# Altium project led_driver.PrjPcb
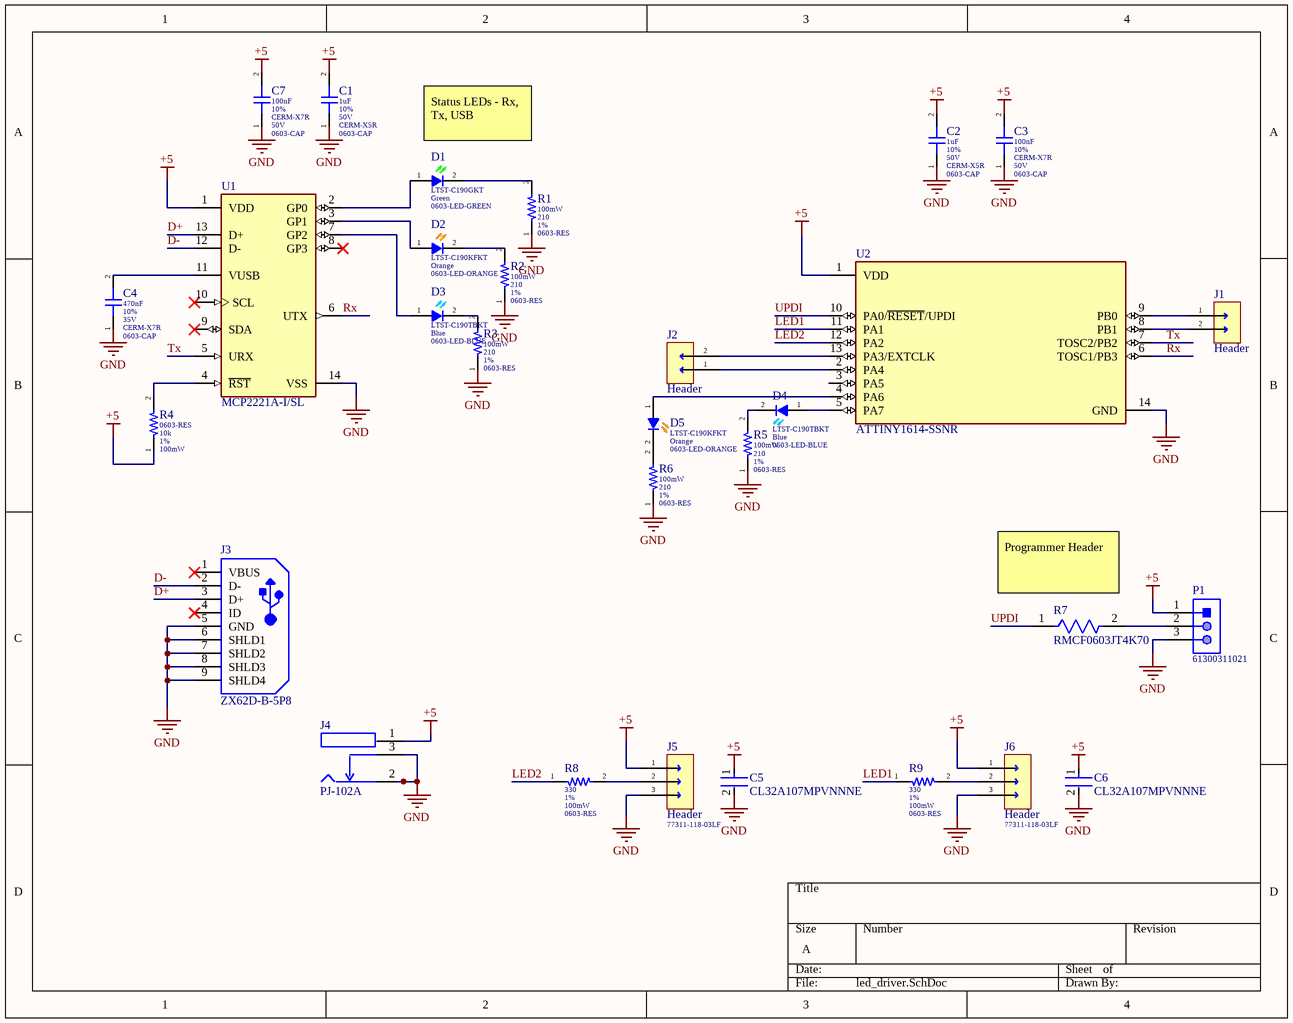
[diagram p0: led_driver.SchDoc]
1 sheet, 30 parts. Net scope: global (net labels, ports and power ports of the same name join across sheets).
Board file: led_driver.PcbDoc

## Sheet led_driver.SchDoc
size A; SheetNumber: 1; SheetTotal: 1

### Parts
C1  Capacitance: 1uF  Tolerance: 10%  Voltage Rating: 50V  Dielectric: CERM-X5R  [0603-CAP]  (hidden comment: CAP SAMSUNG CL10A105KB8NNNC)
C2  Capacitance: 1uF  Tolerance: 10%  Voltage Rating: 50V  Dielectric: CERM-X5R  [0603-CAP]  (hidden comment: CAP SAMSUNG CL10A105KB8NNNC)
C3  Capacitance: 100nF  Tolerance: 10%  Dielectric: CERM-X7R  Voltage: 50V  [0603-CAP]  (hidden comment: CAP TDK CGA3E2X7R1H104K080AA)
C4  Capacitance: 470nF  Tolerance: 10%  Voltage Rating: 35V  Dielectric: CERM-X7R  [0603-CAP]  (hidden comment: CAP TDK CGA3E1X7R1V474K080AC)
C5  CL32A107MPVNNNE  [FP-CL32-IPC_C]
C6  CL32A107MPVNNNE  [FP-CL32-IPC_C]
C7  Capacitance: 100nF  Tolerance: 10%  Dielectric: CERM-X7R  Voltage: 50V  [0603-CAP]  (hidden comment: CAP TDK CGA3E2X7R1H104K080AA)
D1  Manufacturer Part Number: LTST-C190GKT  Color: Green  [0603-LED-GREEN]  (hidden comment: LED LITE-ON LTST-C190GKT)
D2  Manufacturer Part Number: LTST-C190KFKT  Color: Orange  [0603-LED-ORANGE]  (hidden comment: LED LITE-ON LTST-C190KFKT)
D3  Manufacturer Part Number: LTST-C190TBKT  Color: Blue  [0603-LED-BLUE]  (hidden comment: LED LITE-ON LTST-C190TBKT)
D4  Manufacturer Part Number: LTST-C190TBKT  Color: Blue  [0603-LED-BLUE]  (hidden comment: LED LITE-ON LTST-C190TBKT)
D5  Manufacturer Part Number: LTST-C190KFKT  Color: Orange  [0603-LED-ORANGE]  (hidden comment: LED LITE-ON LTST-C190KFKT)
J1  Header  [HEADER 2POS 1ROW 2.54MM W/O BODY]
J2  Header  [HEADER 2POS 1ROW 2.54MM W/O BODY]
J3  ZX62D-B-5P8  [HIRO-ZX62D-B-5P8_V]
J4  PJ-102A  [FP-PJ-102A-MFG]
J5  Header  Manufacturer Part Number: 77311-118-03LF  [HEADER 3POS 1ROW 2.54MM]
J6  Header  Manufacturer Part Number: 77311-118-03LF  [HEADER 3POS 1ROW 2.54MM]
P1  61300311021  [61300311021]
R1  Power Rating: 100mW  Resistance: 210  Tolerance: 1%  [0603-RES]  (hidden comment: RES KOA RK73H1JTTD2100F)
R2  Power Rating: 100mW  Resistance: 210  Tolerance: 1%  [0603-RES]  (hidden comment: RES KOA RK73H1JTTD2100F)
R3  Power Rating: 100mW  Resistance: 210  Tolerance: 1%  [0603-RES]  (hidden comment: RES KOA RK73H1JTTD2100F)
R4  Resistance: 10k  Tolerance: 1%  Power: 100mW  [0603-RES]  (hidden comment: RES BOURNS CR0603AFX-1002EAS)
R5  Power Rating: 100mW  Resistance: 210  Tolerance: 1%  [0603-RES]  (hidden comment: RES KOA RK73H1JTTD2100F)
R6  Power Rating: 100mW  Resistance: 210  Tolerance: 1%  [0603-RES]  (hidden comment: RES KOA RK73H1JTTD2100F)
R7  RMCF0603JT4K70  [FP-RMCF0603-MFG]
R8  Resistance: 330  Tolerance: 1%  Power Rating: 100mW  [0603-RES]  (hidden comment: RES KOA RK73H1JTTD3300F)
R9  Resistance: 330  Tolerance: 1%  Power Rating: 100mW  [0603-RES]  (hidden comment: RES KOA RK73H1JTTD3300F)
U1  MCP2221A-I/SL  [FP-C04-065-SL-MFG]
U2  ATTINY1614-SSNR  [FP-C04-065-D3X-MFG]

### Nets
+5: C1.2 C2.2 C3.2 C5.1 C6.1 C7.2 J4.1 J5.1 J6.1 P1.1 R4.1 U1.1(VDD) U2.1(VDD)
GND: C1.1 C2.1 C3.1 C4.1 C5.2 C6.2 C7.1 J3.5(GND) J3.6(SHLD1) J3.7(SHLD2) J3.8(SHLD3) J3.9(SHLD4) J4.2 J4.3 J5.3 J6.3 P1.3 R1.1 R2.1 R3.1 R5.1 R6.1 U1.14(VSS) U2.14(GND)
D+: J3.3(D+) U1.13(D+)
D-: J3.2(D-) U1.12(D-)
LED1: R9.1 U2.11(PA1)
LED2: R8.1 U2.12(PA2)
Rx: U1.6(UTX) U2.6(TOSC1/PB3)
Tx: U1.5(URX) U2.7(TOSC2/PB2)
UPDI: R7.1 U2.10(PA0/~{RESET}/UPDI)
NetC4_2: C4.2 U1.11(VUSB)
NetD1_1: D1.1 U1.2(GP0)
NetD1_2: D1.2 R1.2
NetD2_1: D2.1 U1.3(GP1)
NetD2_2: D2.2 R2.2
NetD3_1: D3.1 U1.7(GP2)
NetD3_2: D3.2 R3.2
NetD4_1: D4.1 U2.5(PA7)
NetD4_2: D4.2 R5.2
NetD5_1: D5.1 U2.4(PA6)
NetD5_2: D5.2 R6.2
NetJ1_1: J1.1 U2.9(PB0)
NetJ1_2: J1.2 U2.8(PB1)
NetJ2_1: J2.1 U2.2(PA4)
NetJ2_2: J2.2 U2.13(PA3/EXTCLK)
NetJ5_2: J5.2 R8.2
NetJ6_2: J6.2 R9.2
NetP1_2: P1.2 R7.2
NetR4_2: R4.2 U1.4(~{RST})

Not connected (* = marked no-connect by the designer): J3 1(VBUS)* 4(ID)*; U1 8(GP3)* 9(SDA)* 10(SCL)*; U2 3(PA5)

### Notes on the sheet
- Status LEDs - Rx, Tx, USB
- (near R7) Programmer Header

### Library data of the parts
C1 C2 = CAP SAMSUNG CL10A105KB8NNNC: CAP CER 1UF 50V X5R 0603; Supplier 1: Digi-Key; Manufacturer: Samsung; Manufacturer Part Number: CL10A105KB8NNNC; Stock 1: 2147093; Pricing 1: 1=0.17, 10=0.121, 100=0.0568, 500=0.0398, 1000=0.033 (USD); Mount: Surface Mount; Case/Package: 0603; Case Code (Metric): 1608; Case Code (Imperial): 0603; Contact Plating: Tin; Min Operating Temperature: -55°C; Max Operating Temperature: 85°C; Package Quantity: 1; Packaging: Tape and Reel; Termination: Wraparound; Length: 1.6mm; Width: 0.031inch; Thickness: 0.035inch; Depth: 0.8mm; Radiation Hardening: No; ComponentLink1URL: https://www.verical.com/server-webapp/html/getDatasheet?partID=753736&src-supplier=Verical; ComponentLink1Description: https://www.verical.com/server-webapp/html/getDatasheet?partID=753736&src-supplier=Verical; Supplier Part Number 1: 1276-1860-1-ND; CurrentFootprint: 0603-CAP
C3 C7 = CAP TDK CGA3E2X7R1H104K080AA: CAP CER 0.1UF 50V X7R 0603; Supplier 1: Digi-Key; Manufacturer: TDK; Manufacturer Part Number: CGA3E2X7R1H104K080AA; Stock 1: 11391991; Pricing 1: 1=0.1, 10=0.075, 100=0.0335, 500=0.0239, 1000=0.0188 (USD); Mount: Surface Mount; Case/Package: 0603; Weight: 7.1E-05oz; Case Code (Imperial): 0603; Case Code (Metric): 1608; Min Operating Temperature: -55°C; Max Operating Temperature: 125°C; Voltage Rating (DC): 50V; Packaging: Tape and Reel; Package Quantity: 1; Voltage Rating: 50V; Termination: SMD/SMT; Composition: Ceramic; Length: 1.6mm; Height: 0.8mm; Width: 0.8mm; Thickness: 0.035inch; Depth: 0.8mm; Ratings: AEC-Q200; Radiation Hardening: No; REACH SVHC: No SVHC; Lead Free: Lead Free; ComponentLink1URL: http://www.farnell.com/datasheets/1796654.pdf?src-supplier=Mouser; ComponentLink1Description: http://www.farnell.com/datasheets/1796654.pdf?src-supplier=Mouser; ComponentLink2URL: http://product.tdk.com/capacitor/mlcc/en/documents/mlccspec_automotive_general_midvoltage_en.pdf?src-supplier=Future+Electronics; ComponentLink2Description: http://product.tdk.com/capacitor/mlcc/en/documents/mlccspec_automotive_general_midvoltage_en.pdf?src-supplier=Future+Electronics; ComponentLink3URL: http://www.farnell.com/datasheets/1735392.pdf?src-supplier=Element14; ComponentLink3Description: http://www.farnell.com/datasheets/1735392.pdf?src-supplier=Element14; ComponentLink4URL: https://www.verical.com/server-webapp/html/getDatasheet?partID=715867&src-supplier=Verical; ComponentLink4Description: https://www.verical.com/server-webapp/html/getDatasheet?partID=715867&src-supplier=Verical; ComponentLink5URL: http://www.farnell.com/datasheets/1796654.pdf?src-supplier=Newark; ComponentLink5Description: http://www.farnell.com/datasheets/1796654.pdf?src-supplier=Newark; Supplier Part Number 1: 445-5666-1-ND; CurrentFootprint: 0603-CAP
C4 = CAP TDK CGA3E1X7R1V474K080AC: CAP CER 0.47UF 35V X7R 0603; Supplier 1: Digi-Key; Manufacturer: TDK; Manufacturer Part Number: CGA3E1X7R1V474K080AC; Stock 1: 14632; Pricing 1: 1=0.26, 10=0.181, 100=0.1026, 500=0.0725, 1000=0.0634 (USD); Mount: Surface Mount; Case/Package: 0603; Weight: 7.1E-05oz; Case Code (Imperial): 0603; Case Code (Metric): 1608; Min Operating Temperature: -55°C; Max Operating Temperature: 125°C; Packaging: Tape and Reel; Voltage Rating (DC): 35V; Package Quantity: 1; Termination: SMD/SMT; Composition: Ceramic; Length: 1.6mm; Height: 0.8mm; Width: 0.8mm; Thickness: 0.035inch; Depth: 0.8mm; Ratings: AEC-Q200; REACH SVHC: No SVHC; ComponentLink1URL: http://product.tdk.com/capacitor/mlcc/detailed_information.php?lang=en&amp;ref=jp&amp;part_no=CGA3E1X7R1V474K080AC&src-supplier=Mouser; ComponentLink1Description: http://product.tdk.com/capacitor/mlcc/detailed_information.php?lang=en&amp;ref=jp&amp;part_no=CGA3E1X7R1V474K080AC&src-supplier=Mouser; ComponentLink2URL: http://www.farnell.com/datasheets/1796654.pdf?src-supplier=Element14; ComponentLink2Description: http://www.farnell.com/datasheets/1796654.pdf?src-supplier=Element14; Supplier Part Number 1: 445-6928-1-ND; CurrentFootprint: 0603-CAP
C5 C6 = CMP-13271-001285-1: Cap Ceramic 100uF 10V X5R ±20% SMD 1210 +85°C Embossed T/R; Dielectric: X5R; Depth: 2.5mm; Width: 0.098inch; Voltage: 10V; Length: 3.2mm; Capacitance: 100uF; Radiation Hardening: No; Min Operating Temperature: -55°C; Thickness: 0.11inch; Mount: Surface Mount; Case Code (Imperial): 1210; Material: Ceramic; Tolerance: 20%; Contact Plating: Tin; Max Operating Temperature: 85°C; Voltage Rating: 10V; Lead Free: Lead Free; Case Code (Metric): 3225; Height: 2.5mm; Case/Package: 1210; Packaging: Tape and Reel; Voltage Rating (DC): 10V
D1 = LED LITE-ON LTST-C190GKT: LED GREEN CLEAR CHIP SMD; Manufacturer: Vishay Lite-On; Lens Color: Colorless; Luminous Intensity: 6mcd; Forward Voltage: 2.1V; Viewing Angle: 130°; Lens Style: Clear,Diffused,Colorless,Rectangular; Forward Current: 30mA; Power Rating: 100mW; Dominant Wavelength: 569nm; Test Current: 10mA; Number of Elements: 1; Wavelength: 565nm; Voltage: 2V; Reverse Voltage: 5V; Supplier 1: Digi-Key; Stock 1: 773896; Pricing 1: 1=0.26, 10=0.188, 100=0.0888, 500=0.0592, 1000=0.0464 (USD); Mount: Surface Mount; Case/Package: 0603; Number of Pins: 2; Case Code (Metric): 1608; Case Code (Imperial): 0603; Min Operating Temperature: -55°C; Max Operating Temperature: 85°C; Package Quantity: 1; Packaging: Tape and Reel; Illumination Color: Green; Lens Transparency: Clear; Power Dissipation: 100mW; Number of LEDs: 1; Length: 1.6mm; Height: 0.8mm; Width: 0.8mm; Depth: 0.8mm; Radiation Hardening: No; Lead Free: Lead Free; ComponentLink1URL: http://uk.rs-online.com/webdocs/0dc0/0900766b80dc02a6.pdf?src-supplier=RSComponents; ComponentLink1Description: http://uk.rs-online.com/webdocs/0dc0/0900766b80dc02a6.pdf?src-supplier=RSComponents; ComponentLink2URL: https://media.digikey.com/pdf/Data%20Sheets/Lite-On%20PDFs/LTST-C190GKT.pdf?src-supplier=Digi-Key; ComponentLink2Description: https://media.digikey.com/pdf/Data%20Sheets/Lite-On%20PDFs/LTST-C190GKT.pdf?src-supplier=Digi-Key; ComponentLink3URL: http://www1.futureelectronics.com/doc/LITE%20ON/LITE-ON%20LTST-C190GKT.pdf?src-supplier=Future+Electronics; ComponentLink3Description: http://www1.futureelectronics.com/doc/LITE%20ON/LITE-ON%20LTST-C190GKT.pdf?src-supplier=Future+Electronics; ComponentLink4URL: https://media.digikey.com/pdf/Data%20Sheets/Lite-On%20PDFs/LTST-C190GKT.pdf?src-supplier=Mouser; ComponentLink4Description: https://media.digikey.com/pdf/Data%20Sheets/Lite-On%20PDFs/LTST-C190GKT.pdf?src-supplier=Mouser; Supplier Part Number 1: 160-1183-1-ND; CurrentFootprint: 0603-LED-GREEN
D2 D5 = LED LITE-ON LTST-C190KFKT: LED ORANGE CLEAR CHIP SMD; Manufacturer: Vishay Lite-On; Lens Color: Colorless; Power Rating: 75mW; Luminous Intensity: 90mcd; Viewing Angle: 130°; Forward Current: 30mA; Forward Voltage: 2V; Lens Style: Diffused,Colorless,Clear,Rectangular; Dominant Wavelength: 605nm; Test Current: 20mA; Number of Elements: 1; Wavelength: 611nm; Reverse Voltage: 5V; Supplier 1: Digi-Key; Stock 1: 52285; Pricing 1: 1=0.24, 10=0.175, 100=0.0827, 500=0.0551, 1000=0.0432 (USD); Mount: Surface Mount; Case/Package: 0603; Number of Pins: 2; Case Code (Metric): 1608; Case Code (Imperial): 0603; Min Operating Temperature: -55°C; Max Operating Temperature: 85°C; Packaging: Tape and Reel; Package Quantity: 1; Illumination Color: Orange; Lens Transparency: Clear; Power Dissipation: 75mW; Number of LEDs: 1; Length: 3.2mm; Height: 0.8mm; Width: 0.8mm; Depth: 1.6mm; Radiation Hardening: No; Lead Free: Lead Free; ComponentLink1URL: http://www.mouser.com/ds/2/239/LTST-C190KFKT-1141312.pdf?src-supplier=Mouser; ComponentLink1Description: http://www.mouser.com/ds/2/239/LTST-C190KFKT-1141312.pdf?src-supplier=Mouser; ComponentLink2URL: http://www1.futureelectronics.com/doc/LITE%20ON/LITE-ON%20LTST-C190KFKT.pdf?src-supplier=Future+Electronics; ComponentLink2Description: http://www1.futureelectronics.com/doc/LITE%20ON/LITE-ON%20LTST-C190KFKT.pdf?src-supplier=Future+Electronics; ComponentLink3URL: http://optoelectronics.liteon.com/upload/download/DS-22-99-0186/LTST-C190KFKT.PDF?src-supplier=Digi-Key; ComponentLink3Description: http://optoelectronics.liteon.com/upload/download/DS-22-99-0186/LTST-C190KFKT.PDF?src-supplier=Digi-Key; ComponentLink4URL: https://www.verical.com/server-webapp/html/getDatasheet?partID=309341&src-supplier=Verical; ComponentLink4Description: https://www.verical.com/server-webapp/html/getDatasheet?partID=309341&src-supplier=Verical; Supplier Part Number 1: 160-1434-1-ND; CurrentFootprint: 0603-LED-ORANGE
D3 D4 = LED LITE-ON LTST-C190TBKT: LED BLUE CLEAR CHIP SMD; Manufacturer: Vishay Lite-On; Lens Color: Colorless; Viewing Angle: 130°; Forward Voltage: 3.8V; Lens Style: Diffused,Colorless,Clear,Rectangular; Luminous Intensity: 180mcd; Forward Current: 20mA; Dominant Wavelength: 475nm; Number of Elements: 1; Power Dissipation: 76mW; Reverse Voltage: 5V; Wavelength: 468nm; Supplier 1: Digi-Key; Stock 1: 176531; Pricing 1: 1=0.52, 10=0.374, 100=0.1663, 500=0.1164, 1000=0.0956 (USD); Mount: Surface Mount; Case/Package: 0603; Number of Pins: 2; Case Code (Metric): 1608; Case Code (Imperial): 0603; Min Operating Temperature: -20°C; Max Operating Temperature: 80°C; Packaging: Tape and Reel; Test Current: 20mA; Package Quantity: 1; Illumination Color: Blue; Lens Transparency: Clear; Number of LEDs: 1; Length: 1.6mm; Height: 0.8mm; Depth: 0.8mm; Width: 0.8mm; Radiation Hardening: No; Lead Free: Lead Free; ComponentLink1URL: http://www1.futureelectronics.com/doc/LITE%20ON/LITE-ON%20LTST-C190TBKT.pdf?src-supplier=Future+Electronics; ComponentLink1Description: http://www1.futureelectronics.com/doc/LITE%20ON/LITE-ON%20LTST-C190TBKT.pdf?src-supplier=Future+Electronics; ComponentLink2URL: https://www.verical.com/server-webapp/html/getDatasheet?partID=131310&src-supplier=Verical; ComponentLink2Description: https://www.verical.com/server-webapp/html/getDatasheet?partID=131310&src-supplier=Verical; ComponentLink3URL: http://optoelectronics.liteon.com/upload/download/DS-22-99-0224/LTST-C190TBKT.PDF?src-supplier=Digi-Key; ComponentLink3Description: http://optoelectronics.liteon.com/upload/download/DS-22-99-0224/LTST-C190TBKT.PDF?src-supplier=Digi-Key; ComponentLink4URL: http://www.mouser.com/ds/2/239/Lite-On-LTST-C190TBKT-187381.pdf?src-supplier=Mouser; ComponentLink4Description: http://www.mouser.com/ds/2/239/Lite-On-LTST-C190TBKT-187381.pdf?src-supplier=Mouser; ComponentLink5URL: http://datasheet.iiic.cc/lite-on/LTST-C190TBKT.pdf?src-supplier=IIIC; ComponentLink5Description: http://datasheet.iiic.cc/lite-on/LTST-C190TBKT.pdf?src-supplier=IIIC; Supplier Part Number 1: 160-1646-1-ND; CurrentFootprint: 0603-LED-BLUE
J1 J2 = HEADER 2POS: CONN HEADER VERT 2POS 2.54MM
J3 = CMP-0029-00002-1: Right Angle Receptacle Connector, Micro USB, 30 V(AC), -30 to 85 degC, 5-Pin SMD, RoHS, Tape and Reel; Capacitance: 1 uF; Tolerance: 10%; ESR: 7.5 Ohm; Voltage Rating: 35 V; PackageDescription: USB Connector, 5 Position Surface Mount, Length 8 mm, Height 2.65 mm; DatasheetVersion: Aug-16; REACH SVHC: No SVHC; Package Quantity: 2000; ComponentLink1Description: Manufacturer URL; ComponentLink2URL: https://www.hirose.com/product/en/download_file/key_name/ZX62D-B-5P8/category/Catalog/doc_file_id/31704/?file_category_id=5&item_id=02420034000&is_series=; Length: 3.2 mm; ComponentLink1URL: https://www.hirose.com; Radiation Hardening: No; Height: 1.8 mm; Max Operating Temperature: 125degC; Weight: 0.000571 oz; Min Operating Temperature: -55degC; ComponentLink3Description: Package Specification; Width: 1.6 mm; Case Code (Metric): 3216; Mount: Surface Mount; ComponentLink2Description: Datasheet; Case Code (Imperial): 1206; ComponentLink3URL: https://www.hirose.com/product/en/download_file/key_name/ZX62D-B-5P8/category/Drawing%20(2D)/doc_file_id/36535/?file_category_id=6&item_id=02420034000&is_series=; Pins: 2; Resistance: 7.5 Ohm; Packaging: Tape and Reel; RoHSCompliant: True; Voltage Rating (DC): 35 V; Case/Package: 1206; PackageReference: ZX62D-B-5P8
J4 = CMP-2000-06899-2: CONN PWR JACK 2X5.5MM SOLDER; Manufacturer: CUI; Conn Gender: Male; Voltage: 24V; Industry Recognized Mating Diameter: 2.10mm ID (0.083"), 5.50mm OD (0.217"); Number Of Contacts: 3; Number of Positions/Contacts: 2 Conductors, 3 Contacts; Description: DC POWER JACK; Current Rating: 2.5A; Conn Orientation: Right Angle; ComponentLink2URL: http://www.cui.com/product/resource/pj-102a.pdf; Manufacturer Part Number: PJ-102A; Contact Material: Tin,Nickel; Digikey Description: CONN PWR JACK 2X5.5MM SOLDER; RoHS: TRUE; Height: 11.2mm; Category: Conn; Octopart: https://octopart.com/pj-102a-cui-286936; Device Class L1: Connectors; Automotive: No; Package: PJ-102A; Device Class L2: Power Connectors; Temperature Range Low: -25°C; Temperature: -25°C to +85°C; Mouser Description: DC Power Connectors Power Jacks; Lead Free: Yes; Device Class L3: unset; Voltage Rating: 24V; ComponentLink2Description: Datasheet; Temperature Range High: +85°C
J5 J6 = HEADER AMPHENOL 77311-118-03LF: CONN HEADER VERT 3POS 2.54MM; Manufacturer: Amphenol FCI; Number of Contacts: 3; Max Voltage Rating (AC): 1.5kV; Gender: Male; Connector Type: Male Pin; Current Rating: 3A; Insulation Resistance: 5GR; Contact Post Length: 3.05mm; Supplier 1: Digi-Key; Stock 1: 0; Pricing 1: 1=0.21, 10=0.197, 100=0.1362, 500=0.1153, 1000=0.0943, 5000=0.0838, 10000=0.076 (USD); Mount: Through Hole; Contact Plating: Gold,GXT; Contact Material: Bronze; Color: Black; Housing Color: Black; Housing Material: Thermoplastic; Material: Thermoplastic; Min Operating Temperature: -65°C; Max Operating Temperature: 125°C; Number of Rows: 1; Termination: Solder; Packaging: Bulk; Package Quantity: 1000; Number of Positions: 3; Orientation: Straight; Voltage Rating: 1.5kV; Contact Gender: Male; Length: 7.62mm; Pitch: 2.54mm; Depth: 2.4mm; Contact Mating Length: 0.23inch; Radiation Hardening: No; Lead Free: Lead Free; REACH SVHC: No SVHC; Flammability Rating: UL94 V-0; ComponentLink1URL: http://www.farnell.com/datasheets/52620.pdf?src-supplier=Element14; ComponentLink1Description: http://www.farnell.com/datasheets/52620.pdf?src-supplier=Element14; ComponentLink2URL: http://portal.fciconnect.com/Comergent/fci/drawing/77311.pdf?src-supplier=Avnet; ComponentLink2Description: http://portal.fciconnect.com/Comergent/fci/drawing/77311.pdf?src-supplier=Avnet; ComponentLink3URL: http://portal.fciconnect.com/Comergent//fci/drawing/77311.pdf?src-supplier=Digi-Key; ComponentLink3Description: http://portal.fciconnect.com/Comergent//fci/drawing/77311.pdf?src-supplier=Digi-Key; Supplier Part Number 1: 609-5680-ND
P1 = CMP-1502-01061-1: THT Angled Pin Header WR-PHD, Pitch 2.54 mm, Single Row, 3 pins; Manufacturer: Wurth Elektronik; Pitch: 2.54mm; Contact Resistance: 20mOhm; Gender: Male; Pin Number: 3; Rated Current: 3A; Working Voltage: 250VAC; Withstanding Voltage: 500VAC; Package Reference: 61300311021; Manufacturer URL: http://www.we-online.de; Datasheet URL: https://katalog.we-online.de/em/datasheet/6130xx11021.pdf; Row Number: Single; Operating Temperature: -40to105degC; Publisher: WurthElektronik; Orientation: Angled; Mounting Technology: THT; Part Number: 61300311021; Packaging: Bag
R1-R3 R5 R6 = RES KOA RK73H1JTTD2100F: RES 210 OHM 1% 1/8W 0603; Manufacturer: KOA Speer; Voltage Rating: 50V; Temperature Coefficient: 100ppm/°C; Supplier 1: Digi-Key; Stock 1: 4900; Pricing 1: 1=0.1, 10=0.023, 100=0.0095, 1000=0.0043, 2500=0.0037 (USD); Case/Package: 0603; Case Code (Imperial): 0603; Case Code (Metric): 1608; Min Operating Temperature: -55°C; Max Operating Temperature: 155°C; Packaging: Tape and Reel; Package Quantity: 5000; Termination: SMD/SMT; Voltage Rating (DC): 50V; Length: 1.6mm; Height: 0.45mm; Width: 0.8mm; Lead Free: Lead Free; ComponentLink1URL: http://www.mouser.com/ds/2/219/RK73H-5715.pdf?src-supplier=Mouser; ComponentLink1Description: http://www.mouser.com/ds/2/219/RK73H-5715.pdf?src-supplier=Mouser; Supplier Part Number 1: 2019-RK73H1JTTD2100FCT-ND; Manufacturer Part Number: RK73H1JTTD2100F; Current Footprint: 0603-RES
R4 = RES BOURNS CR0603AFX-1002EAS: RESA-AS 0603 10K 1% 100MW TC100; Supplier 1: Digi-Key; Manufacturer: Bourns; Manufacturer Part Number: CR0603AFX-1002EAS; Stock 1: 4756; Pricing 1: 1=0.1, 10=0.075, 100=0.0307, 1000=0.0138, 2500=0.012 (USD); Supplier Part Number 1: CR0603AFX-1002EASCT-ND; Current Footprint: 0603-RES
R7 = CMP-26527-000065-1: RES 4.7K OHM 5% 1/10W 0603; Power Rating: 100mW; Resistance: 4.7kR; Temperature Coefficient: 200ppm/°C; Resistor Type: Thick Film; Mount: Surface Mount; Height: 0.022inch; Case Code (Imperial): 0603; RoHS Compliant: Yes; Construction: Rectangular; Depth: 0.8mm; Series: RMCF; Lead Free: Lead Free; Min Operating Temperature: -55°C; Tolerance: 5%; Contact Plating: Tin; Case Code (Metric): 1608; Size Code: 0603; Military Standard: Not; Features: Automotive AEC-Q200; Number of Terminations: 2; Width: 0.031inch; Max Power Dissipation: 100mW; Case/Package: 0603; Max Operating Temperature: 155°C; Radiation Hardening: No; Length: 1.55mm; Packaging: Tape and Reel
R8 R9 = RES KOA RK73H1JTTD3300F: RES 330 OHM 1% 1/8W 0603; Manufacturer: KOA Speer; Voltage Rating: 50V; Temperature Coefficient: 100ppm/°C; Supplier 1: Digi-Key; Manufacturer Part Number: RK73H1JTTD3300F; Stock 1: 93540; Pricing 1: 1=0.1, 10=0.023, 100=0.0095, 1000=0.0043, 2500=0.0037 (USD); Case/Package: 0603; Case Code (Imperial): 0603; Case Code (Metric): 1608; Min Operating Temperature: -55°C; Max Operating Temperature: 155°C; Packaging: Tape and Reel; Package Quantity: 5000; Composition: Thick Film; Termination: SMD/SMT; Length: 1.6mm; Height: 0.45mm; Width: 0.8mm; REACH SVHC: Unknown; Lead Free: Lead Free; ComponentLink1URL: http://www.farnell.com/datasheets/549017.pdf?src-supplier=Element14; ComponentLink1Description: http://www.farnell.com/datasheets/549017.pdf?src-supplier=Element14; ComponentLink2URL: http://www.mouser.com/ds/2/219/RK73H-5715.pdf?src-supplier=Mouser; ComponentLink2Description: http://www.mouser.com/ds/2/219/RK73H-5715.pdf?src-supplier=Mouser; ComponentLink3URL: https://www.distrelec.biz/Web/Downloads/_t/ds/rk73h-series_eng_jap_tds.pdf?mime=application%2Fpdf&src-supplier=Distrelec; ComponentLink3Description: https://www.distrelec.biz/Web/Downloads/_t/ds/rk73h-series_eng_jap_tds.pdf?mime=application%2Fpdf&src-supplier=Distrelec; Supplier Part Number 1: 2019-RK73H1JTTD3300FCT-ND; Current Footprint: 0603-RES
U1 = CMP-06284-000011-1: IC USB TO I2C/UART 14SOIC; Manufacturer: Microchip; Min Supply Voltage: 3V; Usb Standard: USB 2.0; Max Supply Voltage: 5.5V; Nominal Supply Current: 10-13mA; Automotive Grade: Grade 3; Interface: I2C,UART,USB; Standoff Height: 0.1mm; Max Junction Temp: +150°C; Data Rate: 12Mbits/s; Lead Free: Yes; Height: 1.75mm; Octopart: https://octopart.com/mcp2221a-i%2Fsl-microchip-71704986; Package: C04-065-SL; Digikey Description: IC USB TO I2C/UART 14SOIC; Temperature Range Low: -40°C; Temperature: -40°C to +85°C; Category: IC; Temperature Range High: +85°C; Ambient Temperature Range Low: -40°C; Device Class L1: Integrated Circuits (ICs); Footprint Url: http://ww1.microchip.com/downloads/en/DeviceDoc/14L%20SOIC%203_90%20mm%20%28SL%29%20C04-00065d.pdf; Automotive: Yes; ComponentLink2URL: http://ww1.microchip.com/downloads/en/DeviceDoc/20005565B.pdf; Ambient Temperature Range High: +85°C; RoHS: TRUE; Device Class L3: USB Interface ICs; ComponentLink2Description: Datasheet; Device Class L2: Interface ICs; Manufacturer Part Number: MCP2221A-I/SL; Ipc Land Pattern Name: SOIC127P600X175-14
U2 = CMP-06276-000002-1: IC MCU 8BIT 16KB FLASH 14SOIC; Manufacturer: Microchip; Number Of I/Os: 12; Number Of A/D Converters: 2; Min Supply Voltage: 1.8V; Standoff Height: 0.1mm; Nominal Supply Current: 0.005-10.2mA; Max Supply Voltage: 5.5V; Number Of Pwm Channels: 4; Number Of Adc Channels: 10; Number Of Cores: 1; Interface: SPI,USART,2-Wire; Data Bus Width: 8bits; Number Of Timers/Counters: 5; Frequency: 20MHz; Ram Size: 2KBytes; Memory Size: 16KBytes; Core Architecture: AVR; Device Class L2: Embedded Processors and Controllers; Temperature Range Low: -40°C; Memory Type: FLASH; Device Class L3: Microcontrollers; Temperature Range High: +105°C; Category: IC; Package: C04-065-D3X; Lead Free: Yes; Octopart: https://octopart.com/attiny1614-ssnr-microchip-82955111; Ipc Land Pattern Name: SOIC127P600X175-14; Height: 1.75mm; Number Of Uart Channels: 1; Manufacturer Part Number: ATTINY1614-SSNR; Temperature: -40°C to +105°C; RoHS: TRUE; ComponentLink2Description: Datasheet; Automotive: No; Digikey Description: IC MCU 8BIT 16KB FLASH 14SOIC; Number Of Spi Channels: 1; Device Class L1: Integrated Circuits (ICs); ComponentLink2URL: http://ww1.microchip.com/downloads/en/DeviceDoc/ATtiny1614-DataSheet-DS40001995B.pdf